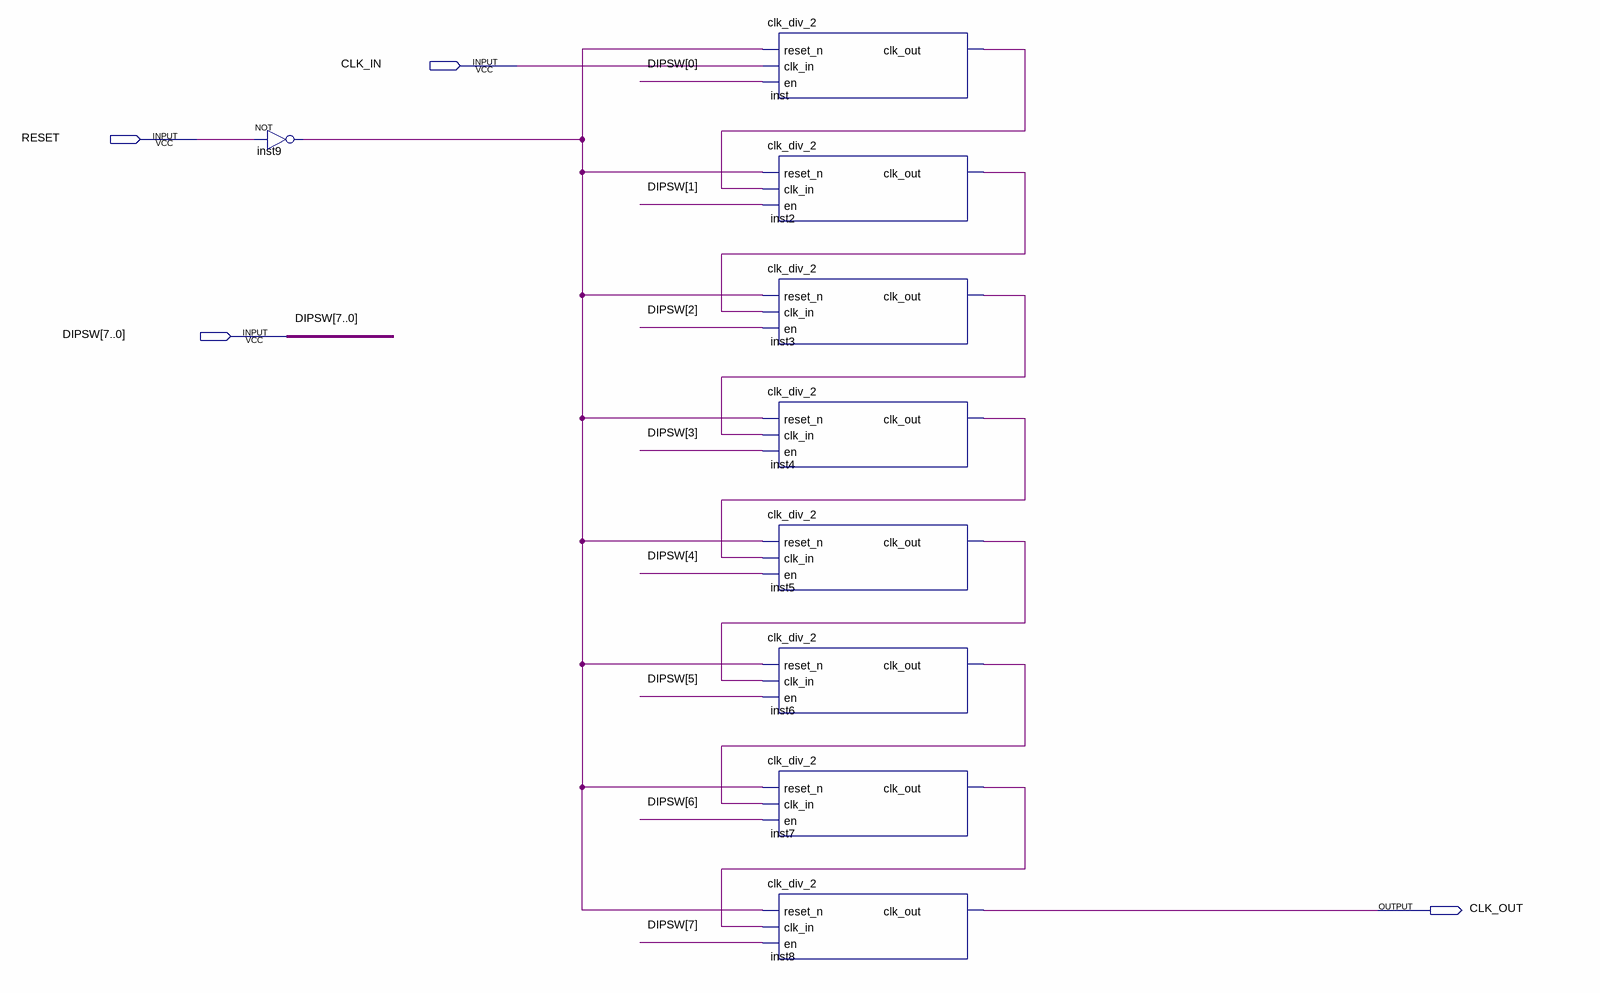
[diagram p0: schematic sheet]
// Quartus schematic clk_div.bdf as structural Verilog: 9 symbols, 4 pins
module clk_div (
  input  CLK_IN,
  input  RESET,
  input  [7:0] DIPSW,
  output CLK_OUT
);

  wire inst2_clk_out, inst3_clk_out, inst4_clk_out, inst5_clk_out, inst6_clk_out, inst7_clk_out, inst9_out,
       inst_clk_out;

  not inst9 (inst9_out, RESET);
  clk_div_2 inst (.reset_n(inst9_out), .clk_in(CLK_IN), .en(DIPSW[0]), .clk_out(inst_clk_out));
  clk_div_2 inst2 (.reset_n(inst9_out), .clk_in(inst_clk_out), .en(DIPSW[1]), .clk_out(inst2_clk_out));
  clk_div_2 inst3 (.reset_n(inst9_out), .clk_in(inst2_clk_out), .en(DIPSW[2]), .clk_out(inst3_clk_out));
  clk_div_2 inst4 (.reset_n(inst9_out), .clk_in(inst3_clk_out), .en(DIPSW[3]), .clk_out(inst4_clk_out));
  clk_div_2 inst5 (.reset_n(inst9_out), .clk_in(inst4_clk_out), .en(DIPSW[4]), .clk_out(inst5_clk_out));
  clk_div_2 inst6 (.reset_n(inst9_out), .clk_in(inst5_clk_out), .en(DIPSW[5]), .clk_out(inst6_clk_out));
  clk_div_2 inst7 (.reset_n(inst9_out), .clk_in(inst6_clk_out), .en(DIPSW[6]), .clk_out(inst7_clk_out));
  clk_div_2 inst8 (.reset_n(inst9_out), .clk_in(inst7_clk_out), .en(DIPSW[7]), .clk_out(CLK_OUT));
endmodule
